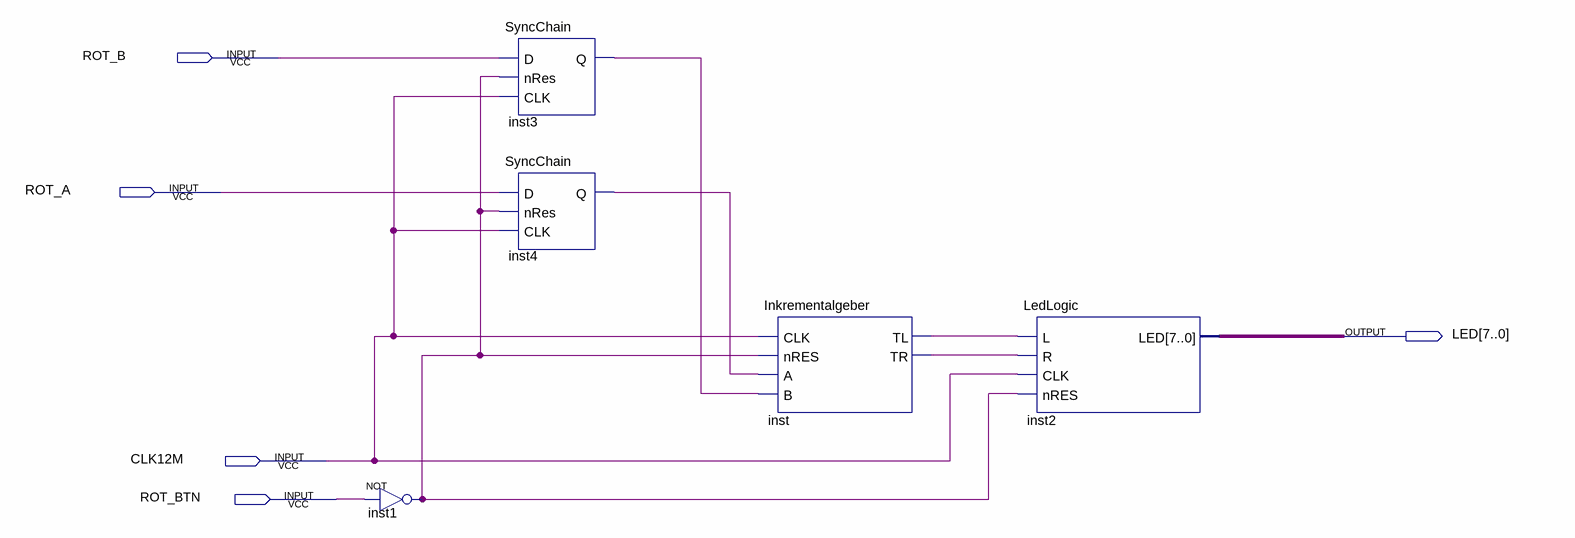
[diagram p0: schematic sheet]
// Quartus schematic RotaryLauflicht.bdf as structural Verilog: 5 symbols, 5 pins
module RotaryLauflicht (
  input  ROT_B,
  input  ROT_A,
  input  CLK12M,
  input  ROT_BTN,
  output [7:0] LED
);

  wire inst1_out, inst3_q, inst4_q, inst_tl, inst_tr;

  not inst1 (inst1_out, ROT_BTN);
  SyncChain inst3 (.D(ROT_B), .nRes(inst1_out), .CLK(CLK12M), .Q(inst3_q));
  SyncChain inst4 (.D(ROT_A), .nRes(inst1_out), .CLK(CLK12M), .Q(inst4_q));
  Inkrementalgeber inst (.CLK(CLK12M), .nRES(inst1_out), .A(inst4_q), .B(inst3_q), .TL(inst_tl), .TR(inst_tr));
  LedLogic inst2 (.L(inst_tl), .R(inst_tr), .CLK(CLK12M), .nRES(inst1_out), .LED(LED));
endmodule
